# Altium schematic sheet Sheet1.SchDoc
size A4
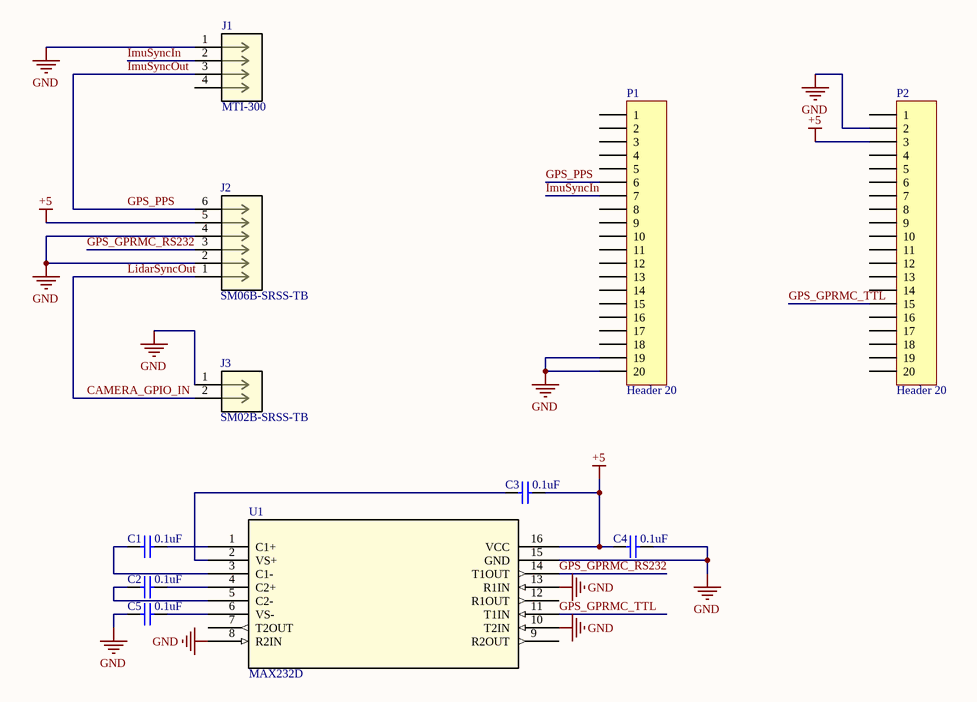
[diagram p0: Sheet1.SchDoc]

## Parts
C1  value 0.1uF  [6-0805_N]  (hidden comment: Cap)
C2  value 0.1uF  [6-0805_N]  (hidden comment: Cap)
C3  value 0.1uF  [6-0805_N]  (hidden comment: Cap)
C4  value 0.1uF  [6-0805_N]  (hidden comment: Cap)
C5  value 0.1uF  [6-0805_N]  (hidden comment: Cap)
J1  MTI-300  [CONN_SM04B-SRSS-TB_JST]
J2  SM06B-SRSS-TB  [CONN_SM06B-SRSS-TB_JST]
J3  SM02B-SRSS-TB  [CONN_SM02B-SRSS-TB_JST]
P1  Header 20  [HDR1X20]
P2  Header 20  [HDR1X20]
U1  MAX232D  [D16]

## Nets
+5: C3.1 C4.2 J2.5 P2.3 U1.16(VCC)
GND: C4.1 C5.2 J1.1 J2.2 J2.4 J3.1 P1.19 P1.20 P2.2 U1.8(R2IN) U1.10(T2IN) U1.13(R1IN) U1.15(GND)
CAMERA_GPIO_IN: J2.1 J3.2  [also labelled LidarSyncOut]
GPS_GPRMC_RS232: J2.3 U1.14(T1OUT)
GPS_GPRMC_TTL: P2.15 U1.11(T1IN)
GPS_PPS: J1.3 J2.6 P1.6  [also labelled ImuSyncOut]
ImuSyncIn: J1.2 P1.7
NetC1_1: C1.1 U1.1(C1+)
NetC1_2: C1.2 U1.3(C1-)
NetC2_1: C2.1 U1.4(C2+)
NetC2_2: C2.2 U1.5(C2-)
NetC3_2: C3.2 U1.2(VS+)
NetC5_1: C5.1 U1.6(VS-)

Not connected (* = marked no-connect by the designer): J1 4; P1 1 2 3 4 5 8 9 10 11 12 13 14 15 16 17 18; P2 1 4 5 6 7 8 9 10 11 12 13 14 16 17 18 19 20; U1 7(T2OUT) 9(R2OUT) 12(R1OUT)

## Library data of the parts
C1-C5 = Cap: Capacitor; Published: 8-Jun-2000; LatestRevisionDate: 17-Jul-2002; LatestRevisionNote: Re-released for DXP Platform.; PackageReference: RAD-0.3; Publisher: Altium Limited; PackageDescription: Radial Cap, Thru-Hole; 2 Leads; 0.3 in Pin Spacing
J1 = SM04B-SRSS-TB: No Description Available; Mfr_Name: JST; RefDes: RefDes; Type: Type
J2 = SM06B-SRSS-TBLFSN: No Description Available; Mfr_Name: JST; RefDes: RefDes; Type: Type
J3 = SM02B-SRSS-TB: No Description Available; Mfr_Name: JST; RefDes: RefDes; Type: Type
P1 P2 = Header 20: Header, 20-Pin; LatestRevisionDate: 17-Jul-2002; LatestRevisionNote: Re-released for DXP Platform.; Publisher: Altium Limited
U1 = MAX232D: No Description Available; Mfr_Name: Texas Instruments; RefDes: RefDes; Type: Type